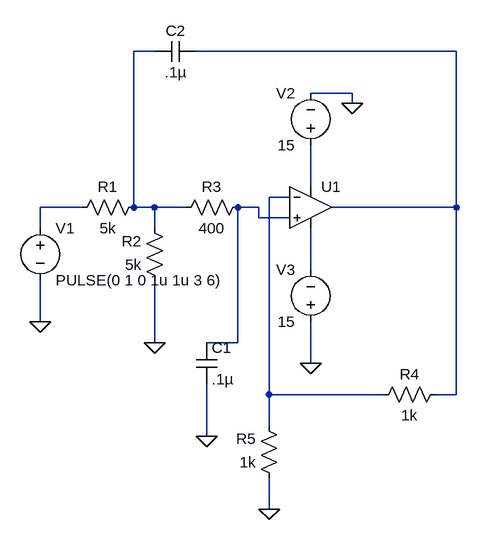
[diagram p0: schematic proj2circuit1.asc]
proj2circuit1.asc, the LTspice schematic file:
Version 4
SHEET 1 880 680
WIRE -48 -176 -80 -176
WIRE 416 -176 16 -176
WIRE 256 -112 192 -112
WIRE 256 -96 256 -112
WIRE 192 32 192 -32
WIRE 160 48 128 48
WIRE -160 64 -224 64
WIRE -80 64 -80 -176
WIRE -48 64 -80 64
WIRE 0 64 -48 64
WIRE 112 64 80 64
WIRE 416 64 416 -176
WIRE 416 64 224 64
WIRE 112 80 112 64
WIRE 160 80 112 80
WIRE -224 96 -224 64
WIRE -48 96 -48 64
WIRE 192 160 192 96
WIRE -224 240 -224 176
WIRE -48 272 -48 176
WIRE 80 272 80 64
WIRE 80 272 32 272
WIRE 192 304 192 240
WIRE 128 352 128 48
WIRE 304 352 128 352
WIRE 416 352 416 64
WIRE 416 352 384 352
WIRE 128 400 128 352
WIRE 32 416 32 336
WIRE 128 528 128 480
FLAG -224 240 0
FLAG 256 -96 0
FLAG 192 304 0
FLAG -48 272 0
FLAG 32 416 0
FLAG 128 528 0
SYMBOL OpAmps\\UniversalOpamp2 192 64 R0
SYMATTR InstName U1
SYMBOL voltage -224 80 R0
WINDOW 123 0 0 Left 0
WINDOW 39 0 0 Left 0
SYMATTR InstName V1
SYMATTR Value PULSE(0 1 0 1u 1u 3 6)
SYMBOL voltage 192 -16 R180
WINDOW 0 24 96 Left 2
WINDOW 3 24 16 Left 2
WINDOW 123 0 0 Left 0
WINDOW 39 0 0 Left 0
SYMATTR InstName V2
SYMATTR Value 15
SYMBOL voltage 192 256 R180
WINDOW 0 24 96 Left 2
WINDOW 3 24 16 Left 2
WINDOW 123 0 0 Left 0
WINDOW 39 0 0 Left 0
SYMATTR InstName V3
SYMATTR Value 15
SYMBOL res -64 48 R90
WINDOW 0 0 56 VBottom 2
WINDOW 3 32 56 VTop 2
SYMATTR InstName R1
SYMATTR Value 5k
SYMBOL res -32 192 R180
WINDOW 0 36 76 Left 2
WINDOW 3 36 40 Left 2
SYMATTR InstName R2
SYMATTR Value 5k
SYMBOL res 96 48 R90
WINDOW 0 0 56 VBottom 2
WINDOW 3 32 56 VTop 2
SYMATTR InstName R3
SYMATTR Value 400
SYMBOL res 400 336 R90
WINDOW 0 0 56 VBottom 2
WINDOW 3 32 56 VTop 2
SYMATTR InstName R4
SYMATTR Value 1k
SYMBOL res 144 496 R180
WINDOW 0 36 76 Left 2
WINDOW 3 36 40 Left 2
SYMATTR InstName R5
SYMATTR Value 1k
SYMBOL cap 16 272 R0
SYMATTR InstName C1
SYMATTR Value .1µ
SYMBOL cap 16 -192 R90
WINDOW 0 0 32 VBottom 2
WINDOW 3 32 32 VTop 2
SYMATTR InstName C2
SYMATTR Value .1µ

The netlist it stands for:
* proj2circuit1.asc
XU1 N006 N004 N003 N007 N002 level.2 Avol=1Meg GBW=10Meg Slew=10Meg ilimit=25m rail=0 Vos=0 phimargin=45 en=0 enk=0 in=0 ink=0 Rin=500Meg  ; pins IN+ IN- V+ V- OUT
V1 N005 0 PULSE(0 1 0 1u 1u 3 6)
V2 N003 0 15
V3 0 N007 15
R1 N001 N005 5k
R2 0 N001 5k
R3 N006 N001 400
R4 N002 N004 1k
R5 0 N004 1k
C1 N006 0 .1µ
C2 N002 N001 .1µ
.lib UniversalOpamps2.sub
.backanno
.end